# Altium schematic sheet DragonflyteConnector.SchDoc
size A
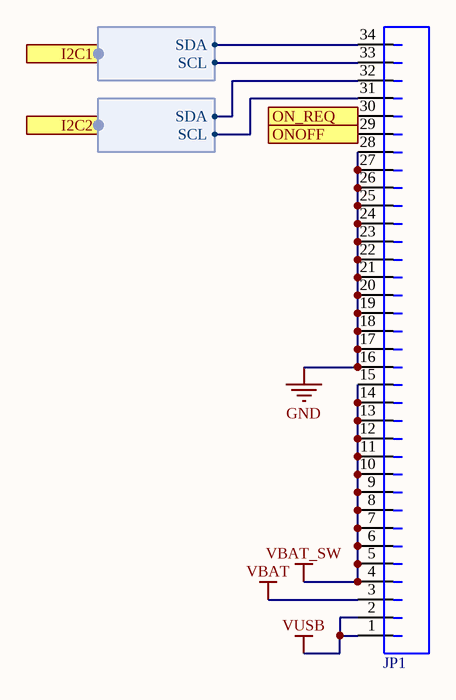
[diagram p0: DragonflyteConnector.SchDoc]

## Parts
JP1  MOLEX_FFC-FPC_34  [MOLEX-FFC-FPC-0.5MM-34]  (value not drawn)

## Ports
I2C1 (harness I2C), I2C2 (harness I2C), ON_REQ (out), ONOFF (in)

## Harnesses
I2C: SCL, SDA

## Nets
GND: JP1.16 JP1.17 JP1.18 JP1.19 JP1.20 JP1.21 JP1.22 JP1.23 JP1.24 JP1.25 JP1.26 JP1.27 JP1.28
VBAT: JP1.3
VBAT_SW: JP1.4 JP1.5 JP1.6 JP1.7 JP1.8 JP1.9 JP1.10 JP1.11 JP1.12 JP1.13 JP1.14 JP1.15
VUSB: JP1.1 JP1.2
ON_REQ: JP1.30 ; port ON_REQ
ONOFF: JP1.29 ; port ONOFF
NetJP1_31: JP1.31 ; port I2C2.SCL
NetJP1_32: JP1.32 ; port I2C2.SDA
NetJP1_33: JP1.33 ; port I2C1.SCL
NetJP1_34: JP1.34 ; port I2C1.SDA

## Library data of the parts
JP1 = MOLEX_FFC-FPC_34: Manufacturer: Molex; PartNumber: 51296-3494; System: Connector; PackageReference: FFC-FPC-0.5; Mounting Technology: Surface Mount